# EAGLE design Controller (EAGLE 7.2.0)
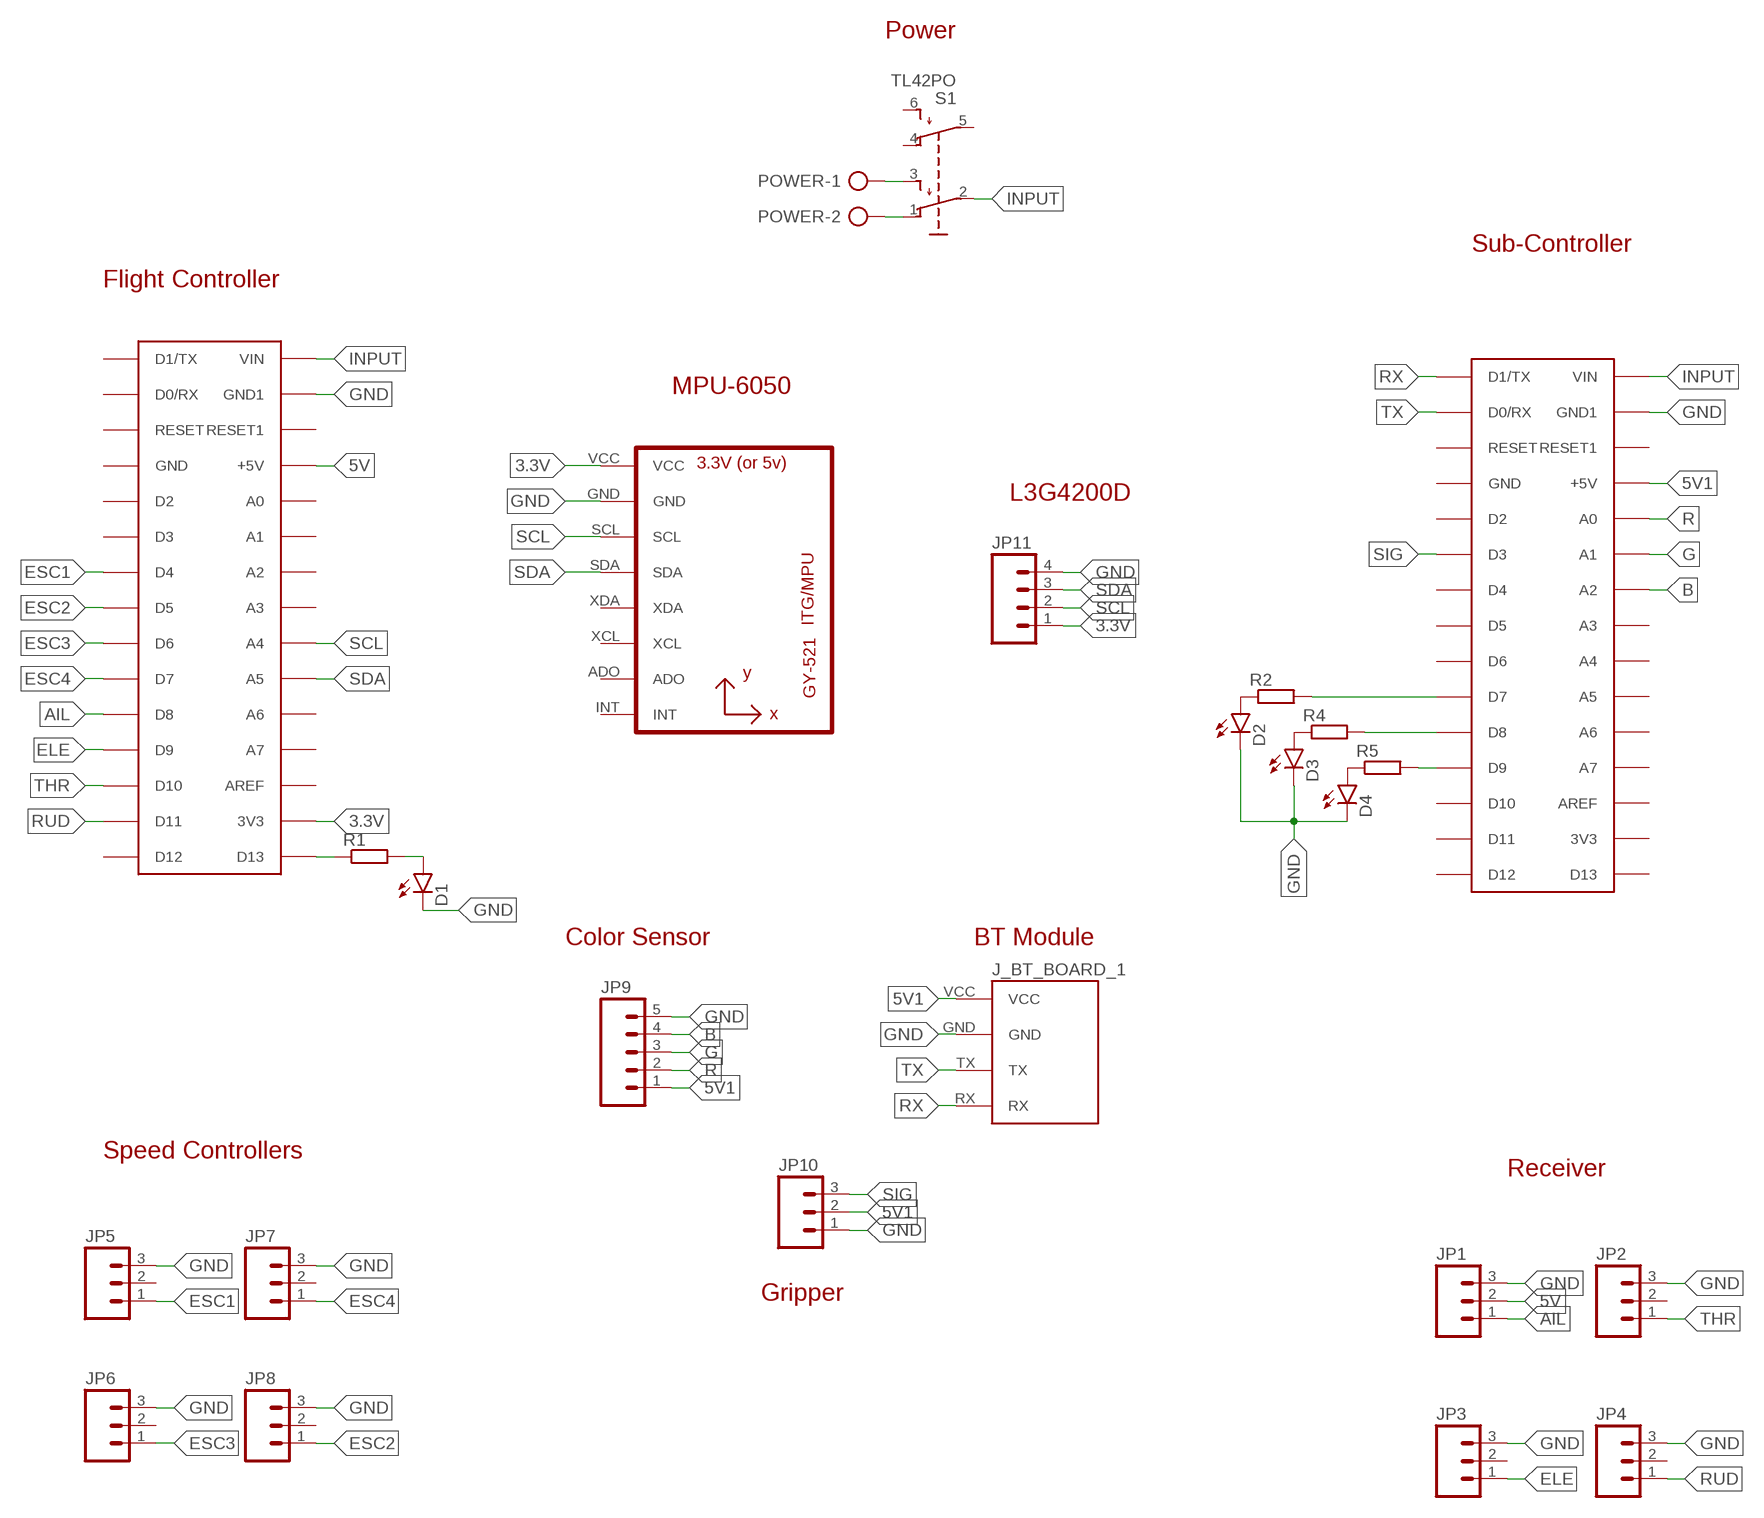
[diagram p0: schematic, sheet 1]

## Parts
D1  LED5MM  [LED5MM]
D2  LED5MM  [LED5MM]
D3  LED5MM  [LED5MM]
D4  LED5MM  [LED5MM]
J_BT_BOARD_1  BLUETOOTH_BOARDSTANDING  [BT_BOARD_FOOTPRINT_STANDING]
JP1  M031X03_NO_SILK  [1X03_NO_SILK]
JP2  M031X03_NO_SILK  [1X03_NO_SILK]
JP3  M031X03_NO_SILK  [1X03_NO_SILK]
JP4  M031X03_NO_SILK  [1X03_NO_SILK]
JP5  M031X03_NO_SILK  [1X03_NO_SILK]
JP6  M031X03_NO_SILK  [1X03_NO_SILK]
JP7  M031X03_NO_SILK  [1X03_NO_SILK]
JP8  M031X03_NO_SILK  [1X03_NO_SILK]
JP9  M05NO_SILK  [1X05_NO_SILK]
JP10  M031X03_NO_SILK  [1X03_NO_SILK]
JP11  M04NO_SILK_ALL_ROUND  [1X04_NO_SILK_ALL_ROUND]
POWER  AK300/2  [AK300/2]
R1  R-EU_0207/10  [0207/10]
R2  R-EU_0207/10  [0207/10]
R4  R-EU_0207/10  [0207/10]
R5  R-EU_0207/10  [0207/10]
S1  TL42PO  [TL4XPO]
U1  GY-521MPU6050  [GY-521]
U$1  ARDUINONANO  [PDIP-32]
U$2  ARDUINONANO  [PDIP-32]

## Nets
3.3V: JP11.1 U1.VCC U$1.3V3
5V: JP1.2 U$1.+5V
5V1: J_BT_BOARD_1.VCC JP9.1 JP10.2 U$2.+5V
AIL: JP1.1 U$1.D8
B: JP9.4 U$2.A2
ELE: JP3.1 U$1.D9
ESC1: JP5.1 U$1.D4
ESC2: JP8.1 U$1.D5
ESC3: JP6.1 U$1.D6
ESC4: JP7.1 U$1.D7
G: JP9.3 U$2.A1
GND: D1.K(C) D2.K(C) D3.K(C) D4.K(C) J_BT_BOARD_1.GND JP1.3 JP2.3 JP3.3 JP4.3 JP5.3 JP6.3 JP7.3 JP8.3 JP9.5 JP10.1 JP11.4 POWER.1 S1.3(S) U1.GND U$1.GND1 U$2.GND1
INPUT: S1.2(P) U$1.VIN U$2.VIN
N: POWER.2 S1.1(O)
N$1: R1.1 U$1.D13
N$2: D1.A R1.2
N$4: R2.2 U$2.D7
N$8: R4.2 U$2.D8
N$9: R5.2 U$2.D9
N$10: D2.A R2.1
N$11: D3.A R4.1
N$14: D4.A R5.1
R: JP9.2 U$2.A0
RUD: JP4.1 U$1.D11
RX: J_BT_BOARD_1.RX U$2.D1/TX
SCL: JP11.2 U1.SCL U$1.A4
SDA: JP11.3 U1.SDA U$1.A5
SIG: JP10.3 U$2.D3
THR: JP2.1 U$1.D10
TX: J_BT_BOARD_1.TX U$2.D0/RX
Unconnected: JP2.2 JP3.2 JP4.2 JP5.2 JP6.2 JP7.2 JP8.2 S1.4(O1) S1.5(P1) S1.6(S1) U1.ADO U1.INT U1.XCL U1.XDA U$1.A0 U$1.A1 U$1.A2 U$1.A3 U$1.A6 U$1.A7 U$1.AREF U$1.D0/RX U$1.D1/TX U$1.D2 U$1.D3 U$1.D12 U$1.GND U$1.RESET U$1.RESET1 U$2.3V3 U$2.A3 U$2.A4 U$2.A5 U$2.A6 U$2.A7 U$2.AREF U$2.D2 U$2.D4 U$2.D5 U$2.D6 U$2.D10 U$2.D11 U$2.D12 U$2.D13 U$2.GND U$2.RESET U$2.RESET1

## Notes on the sheet
- Power
- Sub-Controller
- Flight Controller
- MPU-6050
- L3G4200D
- Color Sensor | BT Module
- Speed Controllers
- Receiver
- Gripper

## Library data of the parts
D1-D4 = SparkFun-LED:LED: LEDs Standard schematic elements and footprints for 5mm, 3mm, 1206, and 0603 sized LEDs. 5mm - Spark Fun Electronics SKU : COM-00529 (and others)
J_BT_BOARD_1 = Bluetooth HC-05:BLUETOOTH_BOARD: Bluetooth Board V1.05
JP1-JP8 JP10 = SparkFun-Connectors:M03: Header 3 Standard 3-pin 0.1" header. Use with straight break away headers (SKU : PRT-00116), right angle break away headers (PRT-00553), swiss pins (PRT-00743), machine pins (PRT-00117), and female headers (PRT-00115). Molex polarized connector foot print use with SKU : PRT-08232 with associated crimp pins and housings.
JP9 = SparkFun-Connectors:M05: Header 5 Standard 5-pin 0.1" header. Use with straight break away headers (SKU : PRT-00116), right angle break away headers (PRT-00553), swiss pins (PRT-00743), machine pins (PRT-00117), and female headers (PRT-00115). Molex polarized connector foot print use with SKU : PRT-08230 with associated crimp pins and housings.
JP11 = SparkFun-Connectors:M04: Header 4 Standard 4-pin 0.1" header. Use with straight break away headers (SKU : PRT-00116), right angle break away headers (PRT-00553), swiss pins (PRT-00743), machine pins (PRT-00117), and female headers (PRT-00115). Molex polarized connector foot print use with SKU : PRT-08231 with associated crimp pins and housings. 1MM SMD Version SKU: PRT-10208
POWER = con-ptr500:AK300/2: CONNECTOR; OC_FARNELL: unknown; OC_NEWARK: unknown
R1 R2 R4 R5 = rcl:R-EU_: RESISTOR, European symbol
S1 = switch:TL42PO: TINY SWITCH ON - MOM Source: http://www2.produktinfo.conrad.com/datenblaetter/700000-724999/705152-da-01-de-Subminiaturschalter_TL_36YO.pdf
U1 = gy-521:GY-521
U$1 U$2 = rocketfarm:ARDUINONANO

## Board
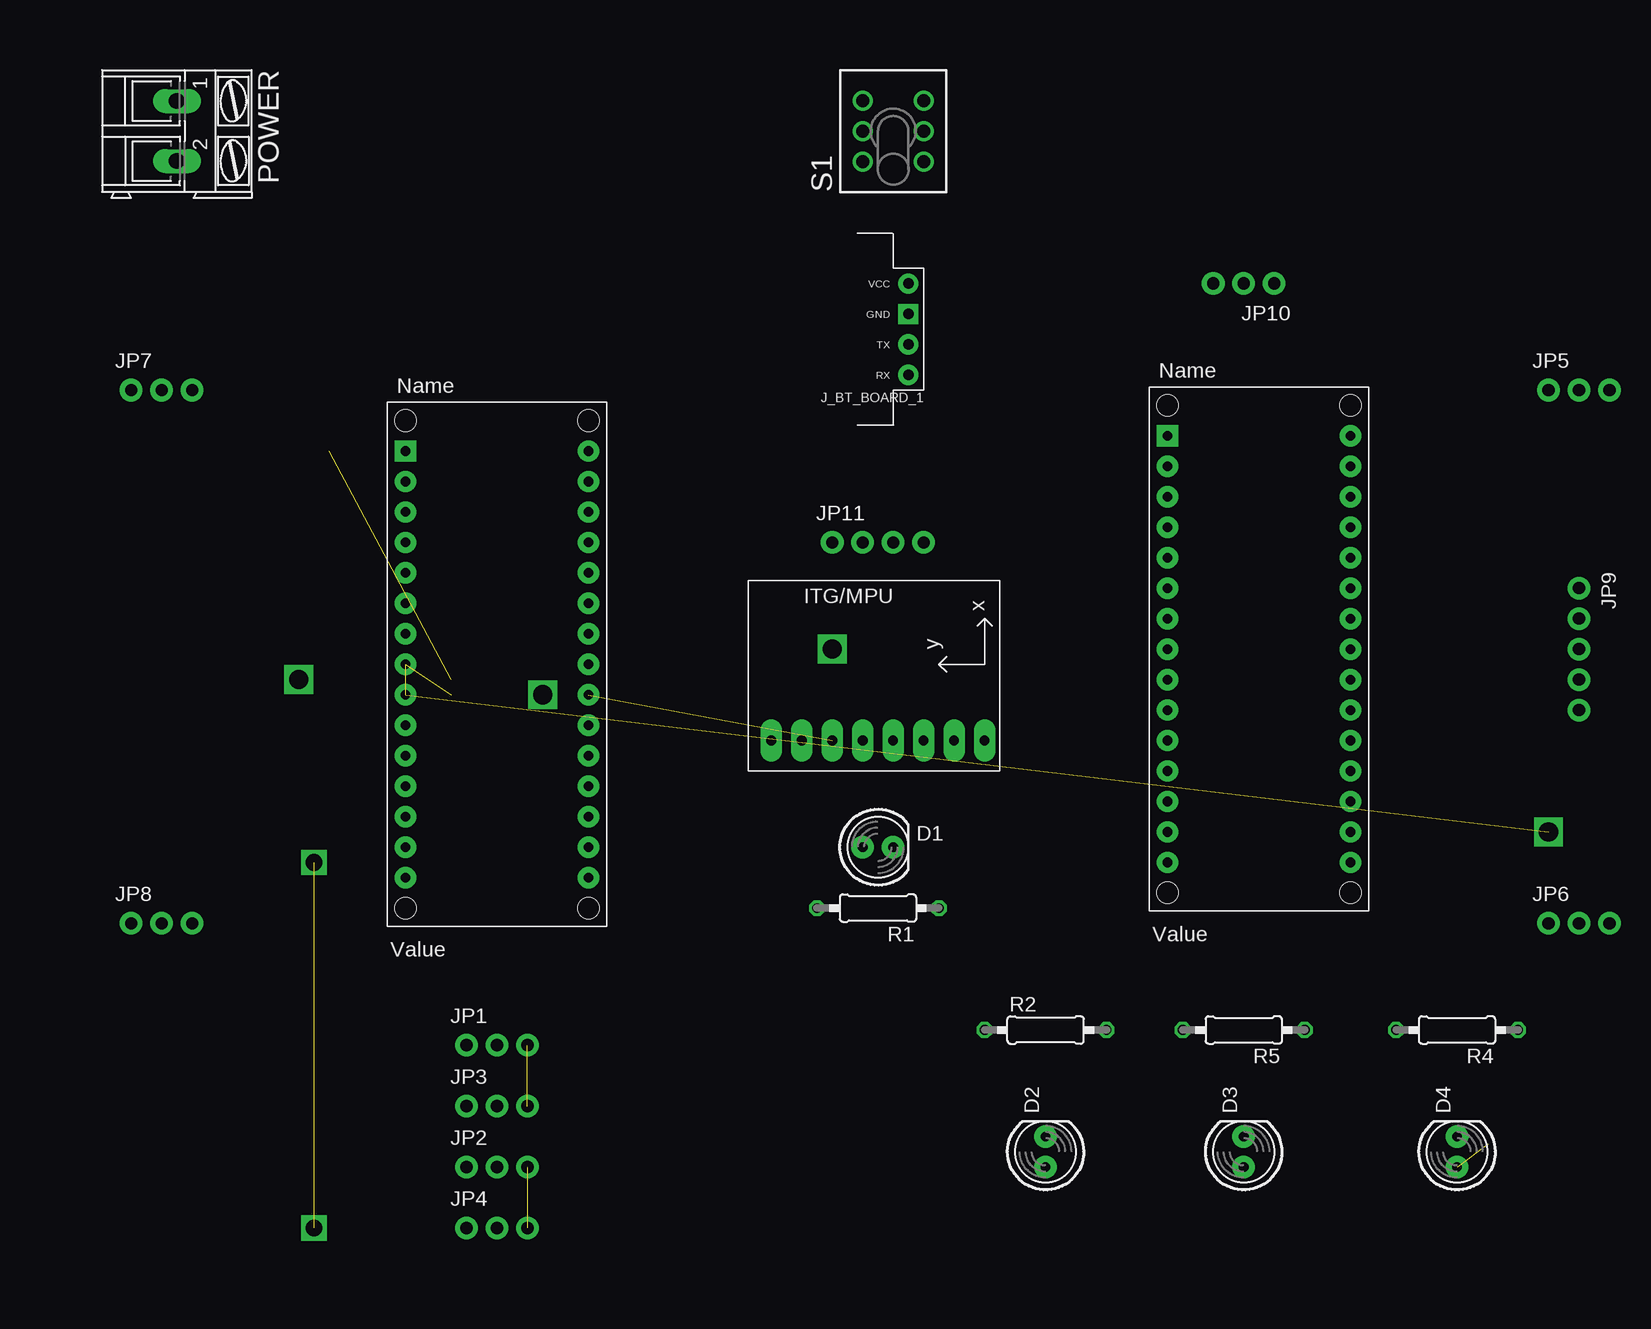
[diagram p1: board, top side]
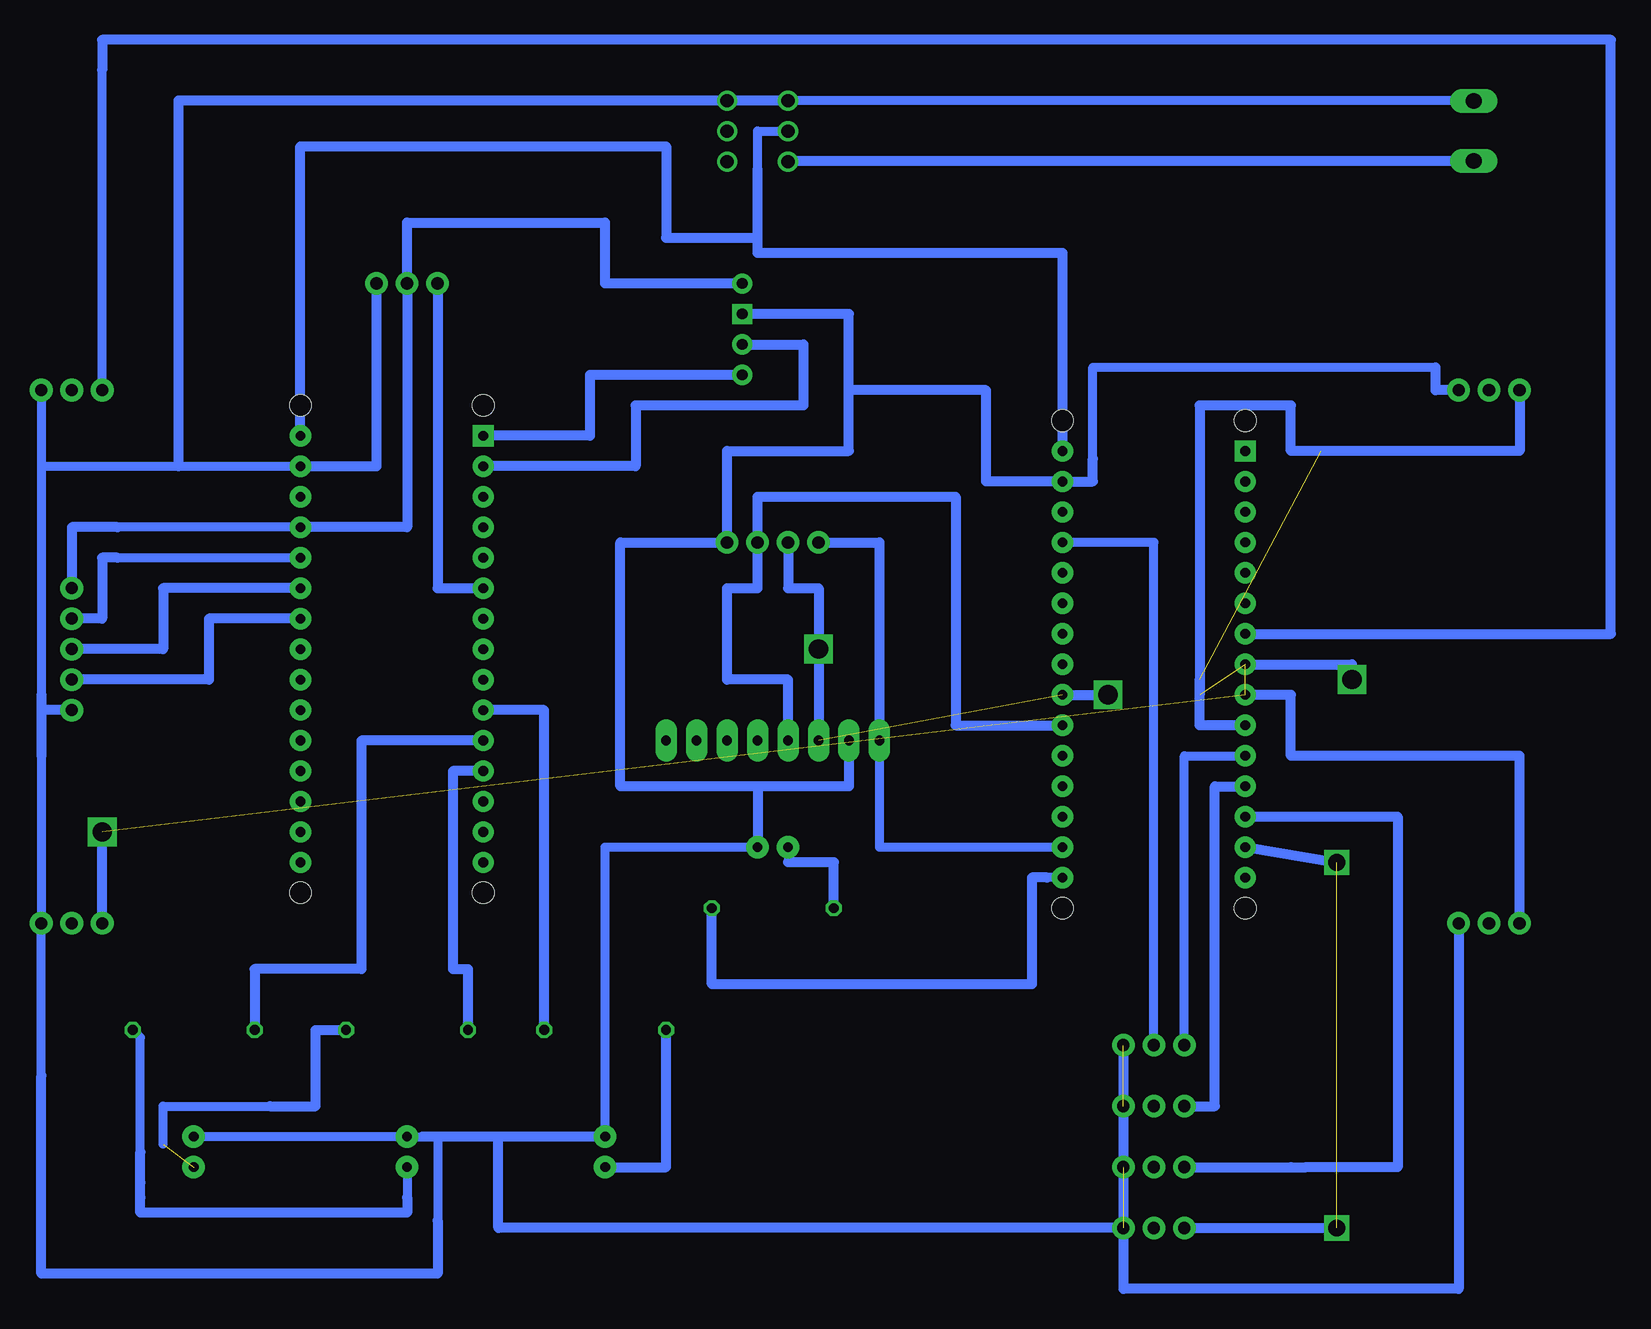
[diagram p2: board, bottom side, seen from below]

No outline drawn. Coordinates in mm, seen from the top.
Copper layers (1*16): Top 0.035mm / dielectric 1.5mm / Bottom 0.035mm
Design rules "default *": minimum track width 30mil, minimum drill 24mil, track to track 30mil, track to pad 30mil, pad to pad 30mil, via to via 30mil, smd to smd 8mil, copper to edge 40mil, drill to drill 8mil, minimum pad ring 10mil, minimum via ring 8mil, stop-mask expansion 4mil, vias tented up to drill 0mil, thermal gap 10mil

### Footprints (pad centres in the part's own frame; a part is rotated, then mirrored left to right if it is on the bottom)
LED5MM = drill 0.813 pad 1.88: A -1.27,0; K 1.27,0
BT_BOARD_FOOTPRINT_STANDING = drill 0.9 pad 1.676 square: GND -3.81,-1.27 | drill 0.9 pad 1.676: RX -3.81,3.81; TX -3.81,1.27; VCC -3.81,-3.81
1X03_NO_SILK = drill 1.016 pad 1.88: 1 0,0; 2 2.54,0; 3 5.08,0
1X05_NO_SILK = drill 1.016 pad 1.88: 1 0,0; 2 2.54,0; 3 5.08,0; 4 7.62,0; 5 10.16,0
1X04_NO_SILK_ALL_ROUND = drill 1.016 pad 1.88: 1 0,0; 2 2.54,0; 3 5.08,0; 4 7.62,0
AK300/2 = drill 1.321 long: 1 -2.515,0; 2 2.489,0
0207/10 = drill 0.813 octagon: 1 -5.08,0; 2 5.08,0
TL4XPO = drill 1.1 pad 1.676: 1 -2.54,2.54; 2 0,2.54; 3 2.54,2.54; 4 -2.54,-2.54; 5 0,-2.54; 6 2.54,-2.54
GY-521 = drill 0.8 pad 1.778 long: ADO -8.89,-6.35; GND -8.89,6.35; INT -8.89,-8.89; SCL -8.89,3.81; SDA -8.89,1.27; VCC -8.89,8.89; XCL -8.89,-3.81; XDA -8.89,-1.27
PDIP-32 = drill 0.8 pad 1.778: 3V3 15.24,-35.56; +5V 15.24,-10.16; A0 15.24,-12.7; A1 15.24,-15.24; A2 15.24,-17.78; A3 15.24,-20.32; A4 15.24,-22.86; A5 15.24,-25.4; A6 15.24,-27.94; A7 15.24,-30.48; AREF 15.24,-33.02; D0/RX 0,-5.08; D2 0,-12.7; D3 0,-15.24; D4 0,-17.78; D5 0,-20.32; D6 0,-22.86; D7 0,-25.4; D8 0,-27.94; D9 0,-30.48; D10 0,-33.02; D11 0,-35.56; D12 0,-38.1; D13 15.24,-38.1; GND 0,-10.16; GND1 15.24,-5.08; RESET 0,-7.62; RESET1 15.24,-7.62; VIN 15.24,-2.54 | drill 0.8 pad 1.778 square: D1/TX 0,-2.54 | hole 1.778: 0,0; 0,-40.64; 15.24,-40.64; 15.24,0

### Placement (x,y rotation side)
D1  81.28,17.78 0 top
D2  95.25,-7.62 90 top
D3  111.76,-7.62 90 top
D4  129.54,-7.62 90 top
J_BT_BOARD_1  80.01,60.96 180 top
JP1  46.99,1.27 0 top
JP2  46.99,-8.89 0 top
JP3  46.99,-3.81 0 top
JP4  46.99,-13.97 0 top
JP5  137.16,55.88 0 top
JP6  137.16,11.43 0 top
JP7  19.05,55.88 0 top
JP8  19.05,11.43 0 top
JP9  139.7,39.37 270 top
JP10  114.3,64.77 180 top
JP11  77.47,43.18 0 top
POWER  22.86,77.47 270 top
R1  81.28,12.7 180 top
R2  95.25,2.54 0 top
R4  129.54,2.54 180 top
R5  111.76,2.54 180 top
S1  82.55,77.47 90 top
U1  81.28,35.56 90 top
U$1  41.91,53.34 0 top
U$2  105.41,54.61 0 top

### Tracks (layer width: path | path; a pad name or v marks a point on that pad's centre or on a via)
3.3V
  Bottom 0.762: U$1.3V3 72.39,17.78 U1.VCC
  Bottom 0.813: JP11.1 72.39,43.18 U1.VCC
5V
  Bottom 0.762: U$1.+5V 49.53,43.18 JP1.2
5V1
  Bottom 0.762: U$2.+5V 135.89,44.45
  Bottom 0.813: 135.89,44.45 139.7,44.45 JP9.1 | U$2.+5V 111.76,44.45 JP10.2 111.76,69.85 95.25,69.85 95.25,64.77 J_BT_BOARD_1.VCC
AIL
  Bottom 0.762: U$1.D8 46.99,25.4 JP1.1
B
  Bottom 0.762: JP9.4 139.06,31.75
  Bottom 0.813: U$2.A2 128.27,36.83 128.27,31.75 JP9.4
ELE
  Bottom 0.813: JP3.1 44.45,-3.81 44.45,22.86 U$1.D9
ESC1
  Bottom 0.762: JP5.1 137.16,82.55
  Bottom 0.813: U$1.D4 11.43,35.56 11.43,85.09 137.16,85.09 137.16,82.55
ESC2  (2 unrouted)
  Bottom 0.813: 19.05,50.8 38.1,50.8 38.1,54.61 45.72,54.61 45.72,30.48 | U$1.D5 33.02,33.02 33.02,31.75 | JP8.1 19.05,25.4 38.1,25.4 38.1,30.48 41.91,30.48
ESC3  (1 unrouted)
  Bottom 0.813: JP6.1 137.16,19.05
ESC4  (1 unrouted)
  Bottom 0.813: JP7.1 19.05,50.8 35.56,50.8 | U$1.D7 45.72,27.94 45.72,31.75
G
  Bottom 0.762: JP9.3 139.06,34.29
  Bottom 0.813: U$2.A1 132.08,39.37 132.08,34.29 139.06,34.29
GND  (2 unrouted)
  Bottom 0.762: 26.04,57.78 54.61,57.78 54.61,50.16 | U$1.GND1 56.52,48.26 | 142.24,26.67 142.24,25.4 JP6.3 142.24,-1.27 142.24,-1.91 | 142.24,49.53 130.81,49.53 U$2.GND1 | JP5.3 142.24,49.53 | 142.24,49.53 142.24,30.48 | D4.K D3.K 110.49,-6.35 109.22,-6.35 109.22,-13.34 | D1.K 95.25,17.78 D2.K | S1.3 22.86,80.01 POWER.1
  Bottom 0.813: 56.52,48.26 54.61,48.26 54.61,50.16 | JP7.3 26.04,55.88 26.04,57.78 | 142.24,30.48 142.24,29.21 | 142.24,29.21 142.24,25.4 | JP9.5 142.24,29.21 | 142.24,-1.27 142.24,-17.78 109.22,-17.78 109.22,-13.34 | 82.55,22.86 74.93,22.86 U1.GND | JP1.3 JP4.3 | JP4.3 52.07,-19.05 24.13,-19.05 JP8.3 | S1.3 130.81,80.01 130.81,49.53 | 82.55,22.86 D1.K | U$2.GND1 114.3,49.53 JP10.1 | 82.55,22.86 93.98,22.86 93.98,43.18 JP11.4 85.09,50.8 74.93,50.8 74.93,55.88 | 74.93,55.88 74.93,62.23 J_BT_BOARD_1.GND | U$1.GND1 63.5,48.26 63.5,55.88 74.93,55.88 | JP4.3 104.14,-13.97 104.14,-6.35 | 104.14,-6.35 110.49,-6.35 | D2.K 104.14,-6.35
INPUT
  Bottom 0.762: S1.2 82.55,77.47 82.55,74.3
  Bottom 0.813: U$1.VIN 57.15,67.31 82.55,67.31 82.55,68.58 | 82.55,68.58 82.55,74.3 | U$2.VIN 120.65,76.2 90.17,76.2 90.17,68.58 82.55,68.58
N
  Bottom 0.813: POWER.2 80.01,74.98 S1.1
N$1
  Bottom 0.762: U$1.D13 58.42,15.24
  Bottom 0.813: 58.42,15.24 59.69,15.24 59.69,6.35 86.36,6.35 R1.1
N$2
  Bottom 0.762: D1.A 80.01,16.51
  Bottom 0.813: R1.2 76.2,16.51 80.01,16.51
N$3  (via drill 1.6)
  other vias: 53.34,30.48
N$4
  Bottom 0.813: R2.2 100.33,29.21 U$2.D7
N$5  (via drill 1.6)
  other vias: 77.47,34.29
N$6  (via drill 1.6)
  other vias: 137.16,19.05
N$7  (via drill 1.6)
  other vias: 33.02,31.75
N$8
  Bottom 0.813: U$2.D8 115.57,26.67 115.57,7.62 124.46,7.62 R4.2
N$9
  Bottom 0.813: U$2.D9 107.95,24.13 107.95,7.62 106.68,7.62 R5.2
N$10
  Bottom 0.813: D2.A 90.17,-8.89 R2.1
N$11
  Bottom 0.762: R4.1 133.99,1.91 133.99,-7.62 | D3.A 111.76,-11.43
  Bottom 0.813: 133.99,-7.62 133.99,-10.16 133.99,-11.43 133.99,-12.7 111.76,-12.7 111.76,-11.43
N$12  (via drill 1.4)
  other vias: 34.29,16.51
N$13  (via drill 1.4)
  other vias: 34.29,-13.97
N$14  (1 unrouted)
  Bottom 0.762: 123.19,-3.81 132.08,-3.81 132.08,-6.99
  Bottom 0.813: 123.19,-3.81 119.38,-3.81 119.38,2.54 R5.1
R
  Bottom 0.762: 135.89,41.91 U$2.A0 | JP9.2 139.06,36.83
  Bottom 0.813: 135.89,41.91 137.16,41.91 137.16,36.83 JP9.2
RUD  (1 unrouted)
  Bottom 0.813: JP4.1 34.29,-13.97 | U$1.D11 34.29,16.51
RX
  Bottom 0.762: U$2.D1/TX 104.78,52.07
  Bottom 0.813: J_BT_BOARD_1.RX 96.52,57.15 96.52,52.07 U$2.D1/TX
SCL  (1 unrouted)
  Bottom 0.813: U$1.A4 53.34,30.48 | U1.SCL 77.47,39.37 80.01,39.37 JP11.2
SDA
  Bottom 0.813: U1.SDA 80.01,31.75 85.09,31.75 85.09,39.37 82.55,39.37 JP11.3 82.55,46.99 66.04,46.99 66.04,27.94 U$1.A5
SIG
  Bottom 0.813: JP10.3 109.22,39.37 U$2.D3
THR
  Bottom 0.813: JP2.1 38.1,-8.89 36.83,-8.89 29.21,-8.89 29.21,20.32 U$1.D10
TX
  Bottom 0.762: U$2.D0/RX 104.78,49.53
  Bottom 0.813: J_BT_BOARD_1.TX 78.74,59.69 78.74,54.61 92.71,54.61 92.71,49.53 U$2.D0/RX